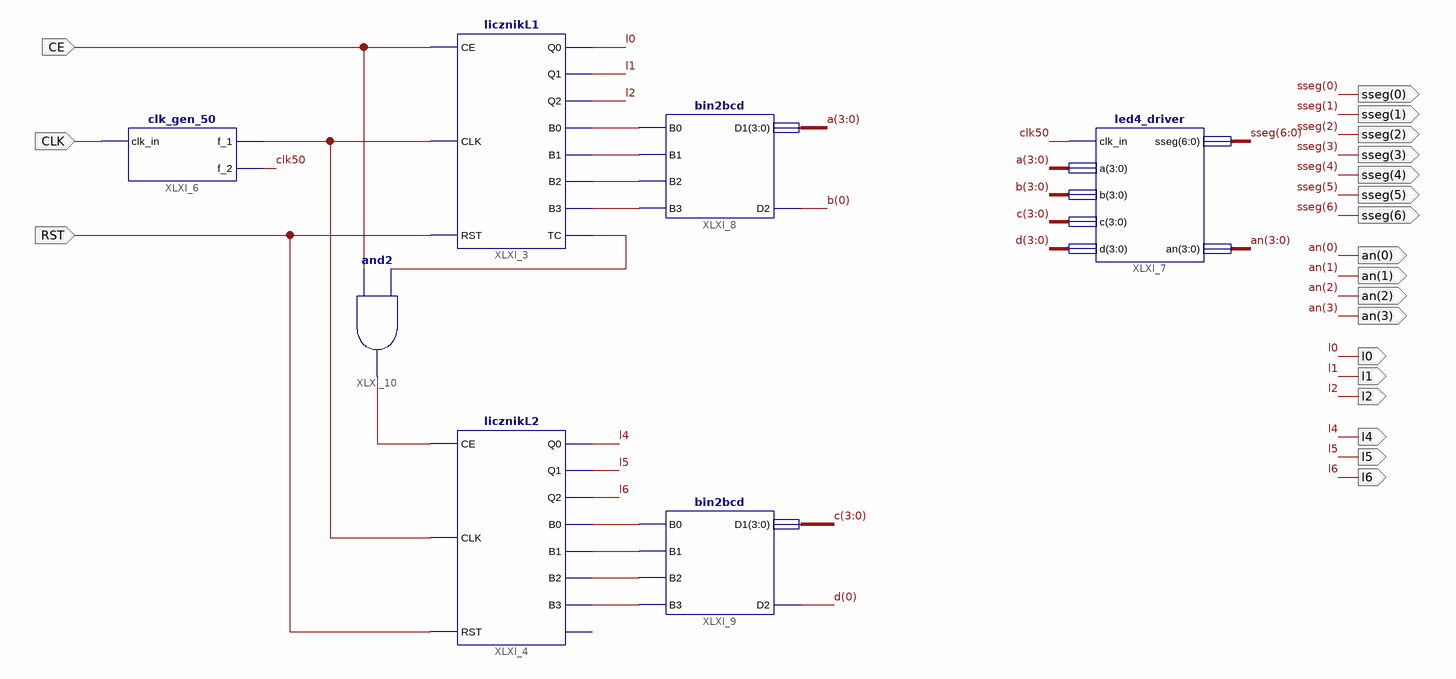
[diagram p0: schematic sheet 1]
// Xilinx ISE schematic symulacja.sch (spartan3e) as structural Verilog: 7 symbols, 20 ports
module symulacja (
  input  CE,
  input  CLK,
  input  RST,
  output [6:0] sseg,
  output [3:0] an,
  output l0,
  output l1,
  output l2,
  output l4,
  output l5,
  output l6
);

  wire clk50, XLXN_5, XLXN_13, XLXN_14, XLXN_15, XLXN_16, XLXN_17, XLXN_18, XLXN_19, XLXN_20, XLXN_21,
       XLXN_23;
  wire [3:0] a, b, c, d;

  licznikL1 XLXI_3 (
    .CE(CE), .CLK(XLXN_21), .RST(RST), .Q0(l0), .Q1(l1), .Q2(l2), .B3(XLXN_20), .B1(XLXN_18), .B0(XLXN_17),
    .B2(XLXN_19), .TC(XLXN_5));
  licznikL2 XLXI_4 (
    .CE(XLXN_23), .CLK(XLXN_21), .RST(RST), .B1(XLXN_14), .B0(XLXN_13), .B2(XLXN_15), .B3(XLXN_16), .Q2(l6),
    .Q1(l5), .Q0(l4));  // open: TC
  led4_driver XLXI_7 (.clk_in(clk50), .a(a), .b(b), .c(c), .d(d), .sseg(sseg), .an(an));
  bin2bcd XLXI_9 (.D1(c), .B0(XLXN_13), .B1(XLXN_14), .B2(XLXN_15), .B3(XLXN_16), .D2(d[0]));
  bin2bcd XLXI_8 (.D1(a), .B0(XLXN_17), .B1(XLXN_18), .B2(XLXN_19), .B3(XLXN_20), .D2(b[0]));
  clk_gen_50 XLXI_6 (.clk_in(CLK), .f_1(XLXN_21), .f_2(clk50));
  and XLXI_10 (XLXN_23, CE, XLXN_5);

  // Notes on the sheet:
  //   LOC on signal CE = G18
  //   LOC on signal CLK = B8
  //   LOC on signal RST = B18
  //   LOC on signal sseg(0) = L18
  //   LOC on signal sseg(1) = F18
  //   LOC on signal sseg(2) = D17
  //   LOC on signal sseg(3) = D16
  //   LOC on signal sseg(4) = G14
  //   LOC on signal sseg(5) = J17
  //   LOC on signal sseg(6) = H14
  //   LOC on signal an(0) = F17
  //   LOC on signal an(1) = H17
  //   LOC on signal an(2) = C18
  //   LOC on signal an(3) = F15
  //   LOC on signal l0 = R4
  //   LOC on signal l1 = F4
  //   LOC on signal l2 = P15
  //   LOC on signal l4 = K14
  //   LOC on signal l5 = K15
  //   LOC on signal l6 = J15
endmodule
